# Altium schematic sheet S06-PERIPHERALS.SchDoc
size B; SheetNumber: 7; SheetTotal: 7; BLOCK-TITLE: JOYSTICK/CAMERA/TFT PERIPHERAL INTERFACES; BLOCK-SIZE: B; BLOCK-PROJECT: MULTIMOD BASE; BLOCK-REVISION: 1; BLOCK-ORGANIZATION: UNIVERSITY OF FLORIDA; BLOCK-DESIGNER: MEHRON TALEBI; BLOCK-IDENTIFIER: SUMMER 2023; BLOCK-REVIEWER: MIKE STAPLETON
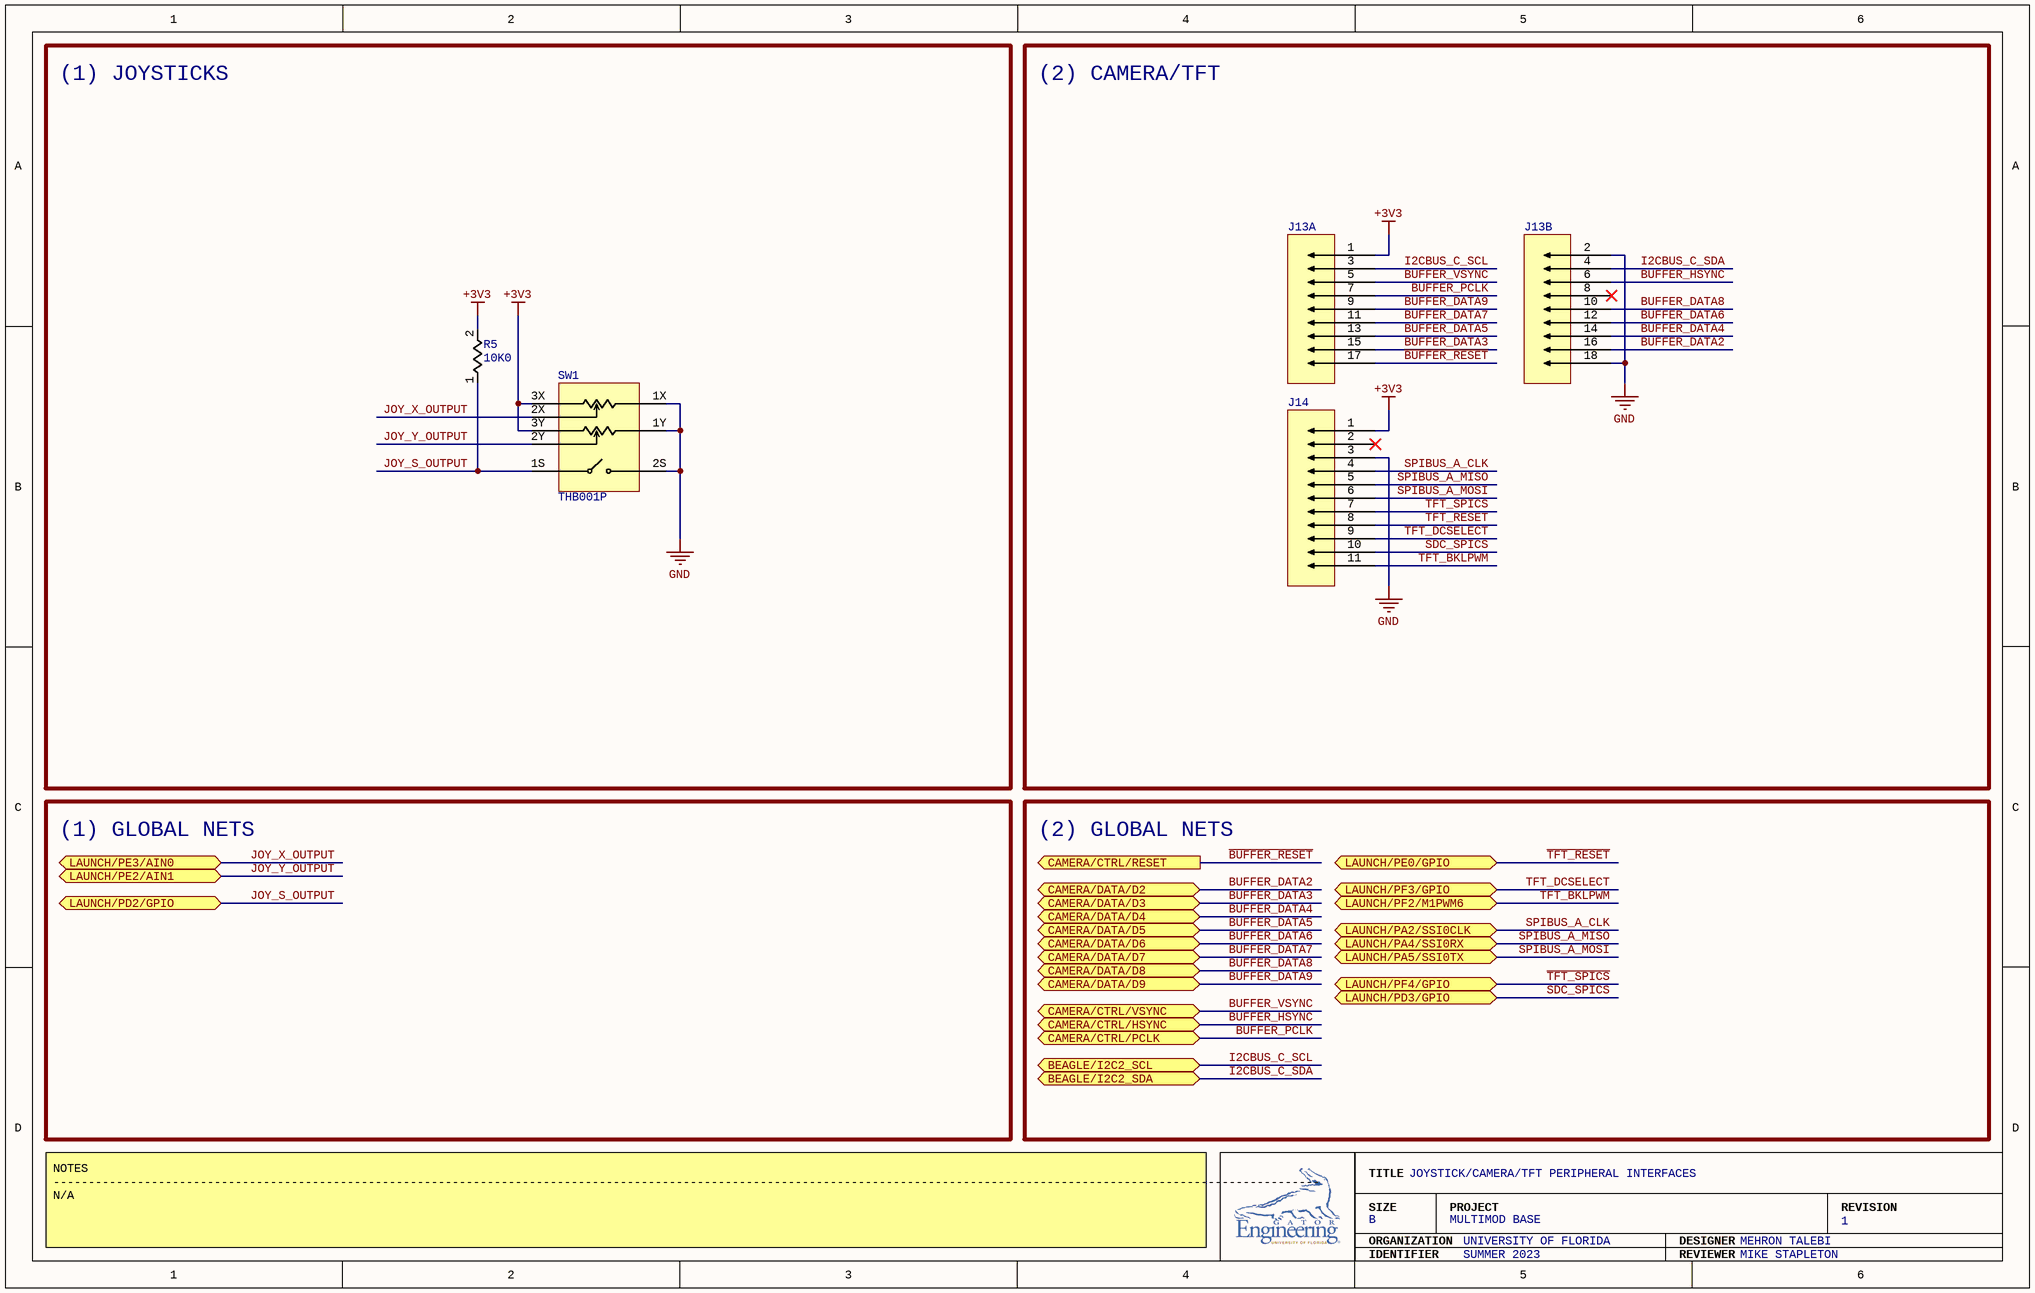
[diagram p0: S06-PERIPHERALS.SchDoc]

## Parts
J13  PPPC092LJBN-RC  [PPPC092LJBN-RC]  (value not drawn)  (parts A,B of 2)
J14  PPPC111LFBN-RC  [PPPC111LFBN-RC]  (value not drawn)
R5  10K0  [RC0805FR-0710KL]
SW1  THB001P  [THB001P]

## Blocks framed on the sheet
(1) JOYSTICKS: R5 SW1
(2) CAMERA/TFT: J13 J14

## Ports
BEAGLE/I2C2_SCL (bidir), BEAGLE/I2C2_SDA (bidir), CAMERA/CTRL/HSYNC (bidir), CAMERA/CTRL/PCLK (bidir), CAMERA/CTRL/RESET (out), CAMERA/CTRL/VSYNC (bidir), CAMERA/DATA/D2 (bidir), CAMERA/DATA/D3 (bidir), CAMERA/DATA/D4 (bidir), CAMERA/DATA/D5 (bidir), CAMERA/DATA/D6 (bidir), CAMERA/DATA/D7 (bidir), CAMERA/DATA/D8 (bidir), CAMERA/DATA/D9 (bidir), LAUNCH/PA2/SSI0CLK (bidir), LAUNCH/PA4/SSI0RX (bidir), LAUNCH/PA5/SSI0TX (bidir), LAUNCH/PD2/GPIO (bidir), LAUNCH/PD3/GPIO (bidir), LAUNCH/PE0/GPIO (bidir), LAUNCH/PE2/AIN1 (bidir), LAUNCH/PE3/AIN0 (bidir), LAUNCH/PF2/M1PWM6 (bidir), LAUNCH/PF3/GPIO (bidir), LAUNCH/PF4/GPIO (bidir)

## Nets
+3V3: J13.1 J14.1 R5.2 SW1.3X SW1.3Y
GND: J13.2 J13.18 J14.3 SW1.1X SW1.1Y SW1.2S
~{BUFFER_RESET}: J13.17 ; port CAMERA/CTRL/RESET
~{SDC_SPICS}: J14.10 ; port LAUNCH/PD3/GPIO
~{TFT_RESET}: J14.8 ; port LAUNCH/PE0/GPIO
~{TFT_SPICS}: J14.7 ; port LAUNCH/PF4/GPIO
BUFFER_DATA2: J13.16 ; port CAMERA/DATA/D2
BUFFER_DATA3: J13.15 ; port CAMERA/DATA/D3
BUFFER_DATA4: J13.14 ; port CAMERA/DATA/D4
BUFFER_DATA5: J13.13 ; port CAMERA/DATA/D5
BUFFER_DATA6: J13.12 ; port CAMERA/DATA/D6
BUFFER_DATA7: J13.11 ; port CAMERA/DATA/D7
BUFFER_DATA8: J13.10 ; port CAMERA/DATA/D8
BUFFER_DATA9: J13.9 ; port CAMERA/DATA/D9
BUFFER_HSYNC: J13.6 ; port CAMERA/CTRL/HSYNC
BUFFER_PCLK: J13.7 ; port CAMERA/CTRL/PCLK
BUFFER_VSYNC: J13.5 ; port CAMERA/CTRL/VSYNC
I2CBUS_C_SCL: J13.3 ; port BEAGLE/I2C2_SCL
I2CBUS_C_SDA: J13.4 ; port BEAGLE/I2C2_SDA
JOY_S_OUTPUT: R5.1 SW1.1S ; port LAUNCH/PD2/GPIO
JOY_X_OUTPUT: SW1.2X ; port LAUNCH/PE3/AIN0
JOY_Y_OUTPUT: SW1.2Y ; port LAUNCH/PE2/AIN1
SPIBUS_A_CLK: J14.4 ; port LAUNCH/PA2/SSI0CLK
SPIBUS_A_MISO: J14.5 ; port LAUNCH/PA4/SSI0RX
SPIBUS_A_MOSI: J14.6 ; port LAUNCH/PA5/SSI0TX
TFT_BKLPWM: J14.11 ; port LAUNCH/PF2/M1PWM6
TFT_DCSELECT: J14.9 ; port LAUNCH/PF3/GPIO

Not connected (* = marked no-connect by the designer): J13 8*; J14 2*

## Notes on the sheet
- (1) GLOBAL NETS
- (2) GLOBAL NETS
- NOTES
  -------------------------------------------------------------------------------------------------------------------------------------------------------------------------------------
  N/A
- TITLE
- SIZE
- ORGANIZATION
- PROJECT
- DESIGNER
- REVISION
- IDENTIFIER
- REVIEWER

## Library data of the parts
J13 = PPPC092LJBN-RC: CONN HDR 18POS 0.1 GOLD PCB R/A; Connector Type: Header; Style: Board to Board; Number of Positions: 18; Number of Positions Loaded: All; Pitch - Mating: 0.100" (2.54mm); Contact Length - Post: 0.124" (3.15mm); Material Flammability Rating: UL94 V-0; Current Rating (Amps): 3A; Voltage Rating: 250V; Contact Type: Female Socket; Number of Rows: 2; Row Spacing - Mating: 0.100" (2.54mm); Mounting Type: Through Hole, Right Angle; Termination: Solder; Fastening Type: Push-Pull; Contact Finish - Mating: Gold; Contact Finish Thickness - Mating: Flash; Insulation Color: Black; Insulation Height: 0.200" (5.08mm); Operating Temperature: -40°C ~ 105°C; Contact Finish - Post: Gold; Insulation Material: Polyester; Contact Shape: Square; Contact Material: Phosphor Bronze; Contact Finish Thickness - Post: Flash; Supplier 1: Digi-Key; Supplier Part Number 1: S5562-ND
J14 = PPPC111LFBN-RC: CONN HDR 11POS 0.1 GOLD PCB; Connector Type: Header; Style: Board to Board; Number of Positions: 11; Number of Positions Loaded: All; Pitch - Mating: 0.100" (2.54mm); Contact Length - Post: 0.126" (3.20mm); Material Flammability Rating: UL94 V-0; Current Rating (Amps): 3A; Contact Type: Female Socket; Number of Rows: 1; Mounting Type: Through Hole; Termination: Solder; Fastening Type: Push-Pull; Contact Finish - Mating: Gold; Contact Finish Thickness - Mating: Flash; Insulation Color: Black; Insulation Height: 0.335" (8.51mm); Operating Temperature: -40°C ~ 105°C; Contact Finish - Post: Gold; Insulation Material: Polyester; Contact Shape: Square; Contact Material: Phosphor Bronze; Contact Finish Thickness - Post: Flash; Supplier 1: Digi-Key; Supplier Part Number 1: S7044-ND
R5 = RC0805FR-0710KL: RES 10K OHM 1% 1/8W 0805; Resistance: 10 kOhms; Power (Watts): 0.125W, 1/8W; Temperature Coefficient: ±100ppm/°C; Tolerance: ±1%; Composition: Thick Film; Features: Moisture Resistant; Operating Temperature: -55°C ~ 155°C; Package / Case: 0805 (2012 Metric); Supplier Device Package: 0805; Size / Dimension: 0.079" L x 0.049" W (2.00mm x 1.25mm); Height - Seated (Max): 0.024" (0.60mm); Number of Terminations: 2; Supplier 1: Future Electronics; Supplier Part Number 1: 3310877
SW1 = THB001P: THUMBSTICK DUAL AXIS W/MOM PB; Actuator Type: Joystick; Switch Function: 360° Directional, Center Select; Output: Analog (Resistive); Voltage Rating - AC: 50 V; Voltage Rating - DC: 5 V; Resistance: 10 kOhms; Electrical Life: 1,000,000 Cycles; Operating Force: 160gf; Type: Joystick, 2 - Axis; Mounting Type: Through Hole; Termination Style: PC Pin; Operating Temperature: -10°C ~ 70°C; Features: Center Tap; Supplier 1: Newark; Supplier Part Number 1: 66AH3097